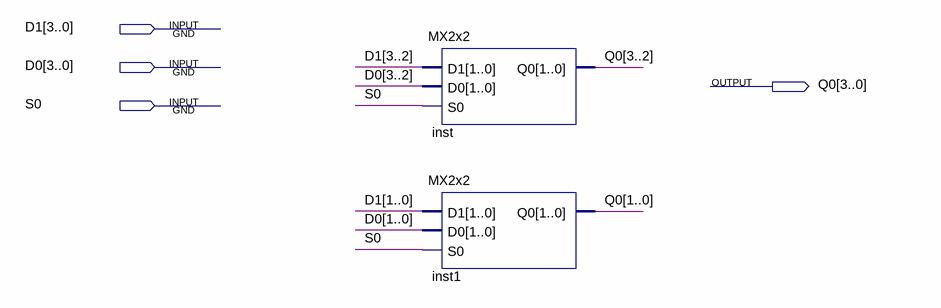
[diagram p0: schematic sheet]
// Quartus schematic MX2x4.bdf as structural Verilog: 2 symbols, 4 pins
module MX2x4 (
  input  [3:0] D1,
  input  [3:0] D0,
  input  S0,
  output [3:0] Q0
);

  MX2x2 inst (.D1(D1[3:2]), .D0(D0[3:2]), .S0(S0), .Q0(Q0[3:2]));
  MX2x2 inst1 (.D1(D1[1:0]), .D0(D0[1:0]), .S0(S0), .Q0(Q0[1:0]));
endmodule
